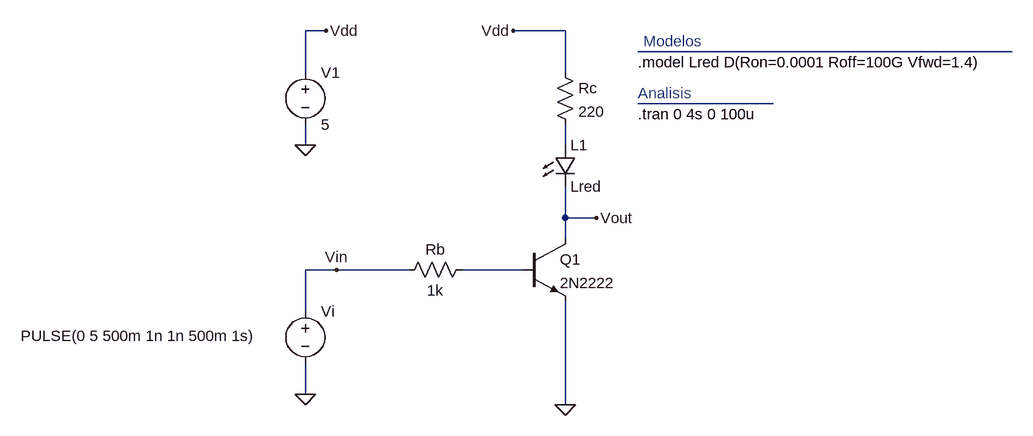
[diagram p0: schematic bjt_switch-ejemplo10.asc]
bjt_switch-ejemplo10.asc, the LTspice schematic file:
Version 4
SHEET 1 880 680
WIRE -464 -496 -496 -496
WIRE -96 -496 -176 -496
WIRE 592 -464 16 -464
WIRE -496 -432 -496 -496
WIRE -96 -432 -96 -496
WIRE 224 -384 16 -384
WIRE -496 -320 -496 -352
WIRE -96 -320 -96 -352
WIRE -96 -208 -96 -256
WIRE -48 -208 -96 -208
WIRE -96 -176 -96 -208
WIRE -448 -128 -496 -128
WIRE -336 -128 -448 -128
WIRE -160 -128 -256 -128
WIRE -496 -64 -496 -128
WIRE -496 64 -496 16
WIRE -96 80 -96 -80
FLAG -96 80 0
FLAG -496 -320 0
FLAG -464 -496 Vdd
FLAG -496 64 0
FLAG -176 -496 Vdd
FLAG -48 -208 Vout
FLAG -448 -128 Vin
SYMBOL npn -160 -176 R0
SYMATTR InstName Q1
SYMATTR Value 2N2222
SYMBOL res -352 -112 R270
WINDOW 0 32 56 VTop 2
WINDOW 3 0 56 VBottom 2
SYMATTR InstName Rb
SYMATTR Value 1k
SYMBOL res -112 -448 R0
SYMATTR InstName Rc
SYMATTR Value 220
SYMBOL voltage -496 -448 R0
WINDOW 123 0 0 Left 0
WINDOW 39 0 0 Left 0
SYMATTR InstName V1
SYMATTR Value 5
SYMBOL voltage -496 -80 R0
WINDOW 3 -438 54 Left 2
WINDOW 123 0 0 Left 0
WINDOW 39 0 0 Left 0
SYMATTR Value PULSE(0 5 500m 1n 1n 500m 1s)
SYMATTR InstName Vi
SYMBOL LED -112 -320 R0
SYMATTR InstName L1
SYMATTR Value Lred
TEXT 16 -368 Left 2 !.tran 0 4s 0 100u
TEXT 16 -400 Left 2 ;Analisis
TEXT 16 -448 Left 2 !.model Lred D(Ron=0.0001 Roff=100G Vfwd=1.4)
TEXT 24 -480 Left 2 ;Modelos

The netlist it stands for:
* bjt_switch-ejemplo10.asc
Q1 Vout N004 0 0 2N2222
Rb Vin N004 1k
Rc Vdd N003 220
V1 Vdd 0 5
Vi Vin 0 PULSE(0 5 500m 1n 1n 500m 1s)
D§L1 N003 Vout Lred
.model D D
.lib standard.dio
.model NPN NPN
.model PNP PNP
.lib standard.bjt
.tran 0 4s 0 100u
* Analisis
.model Lred D(Ron=0.0001 Roff=100G Vfwd=1.4)
* Modelos
.backanno
.end